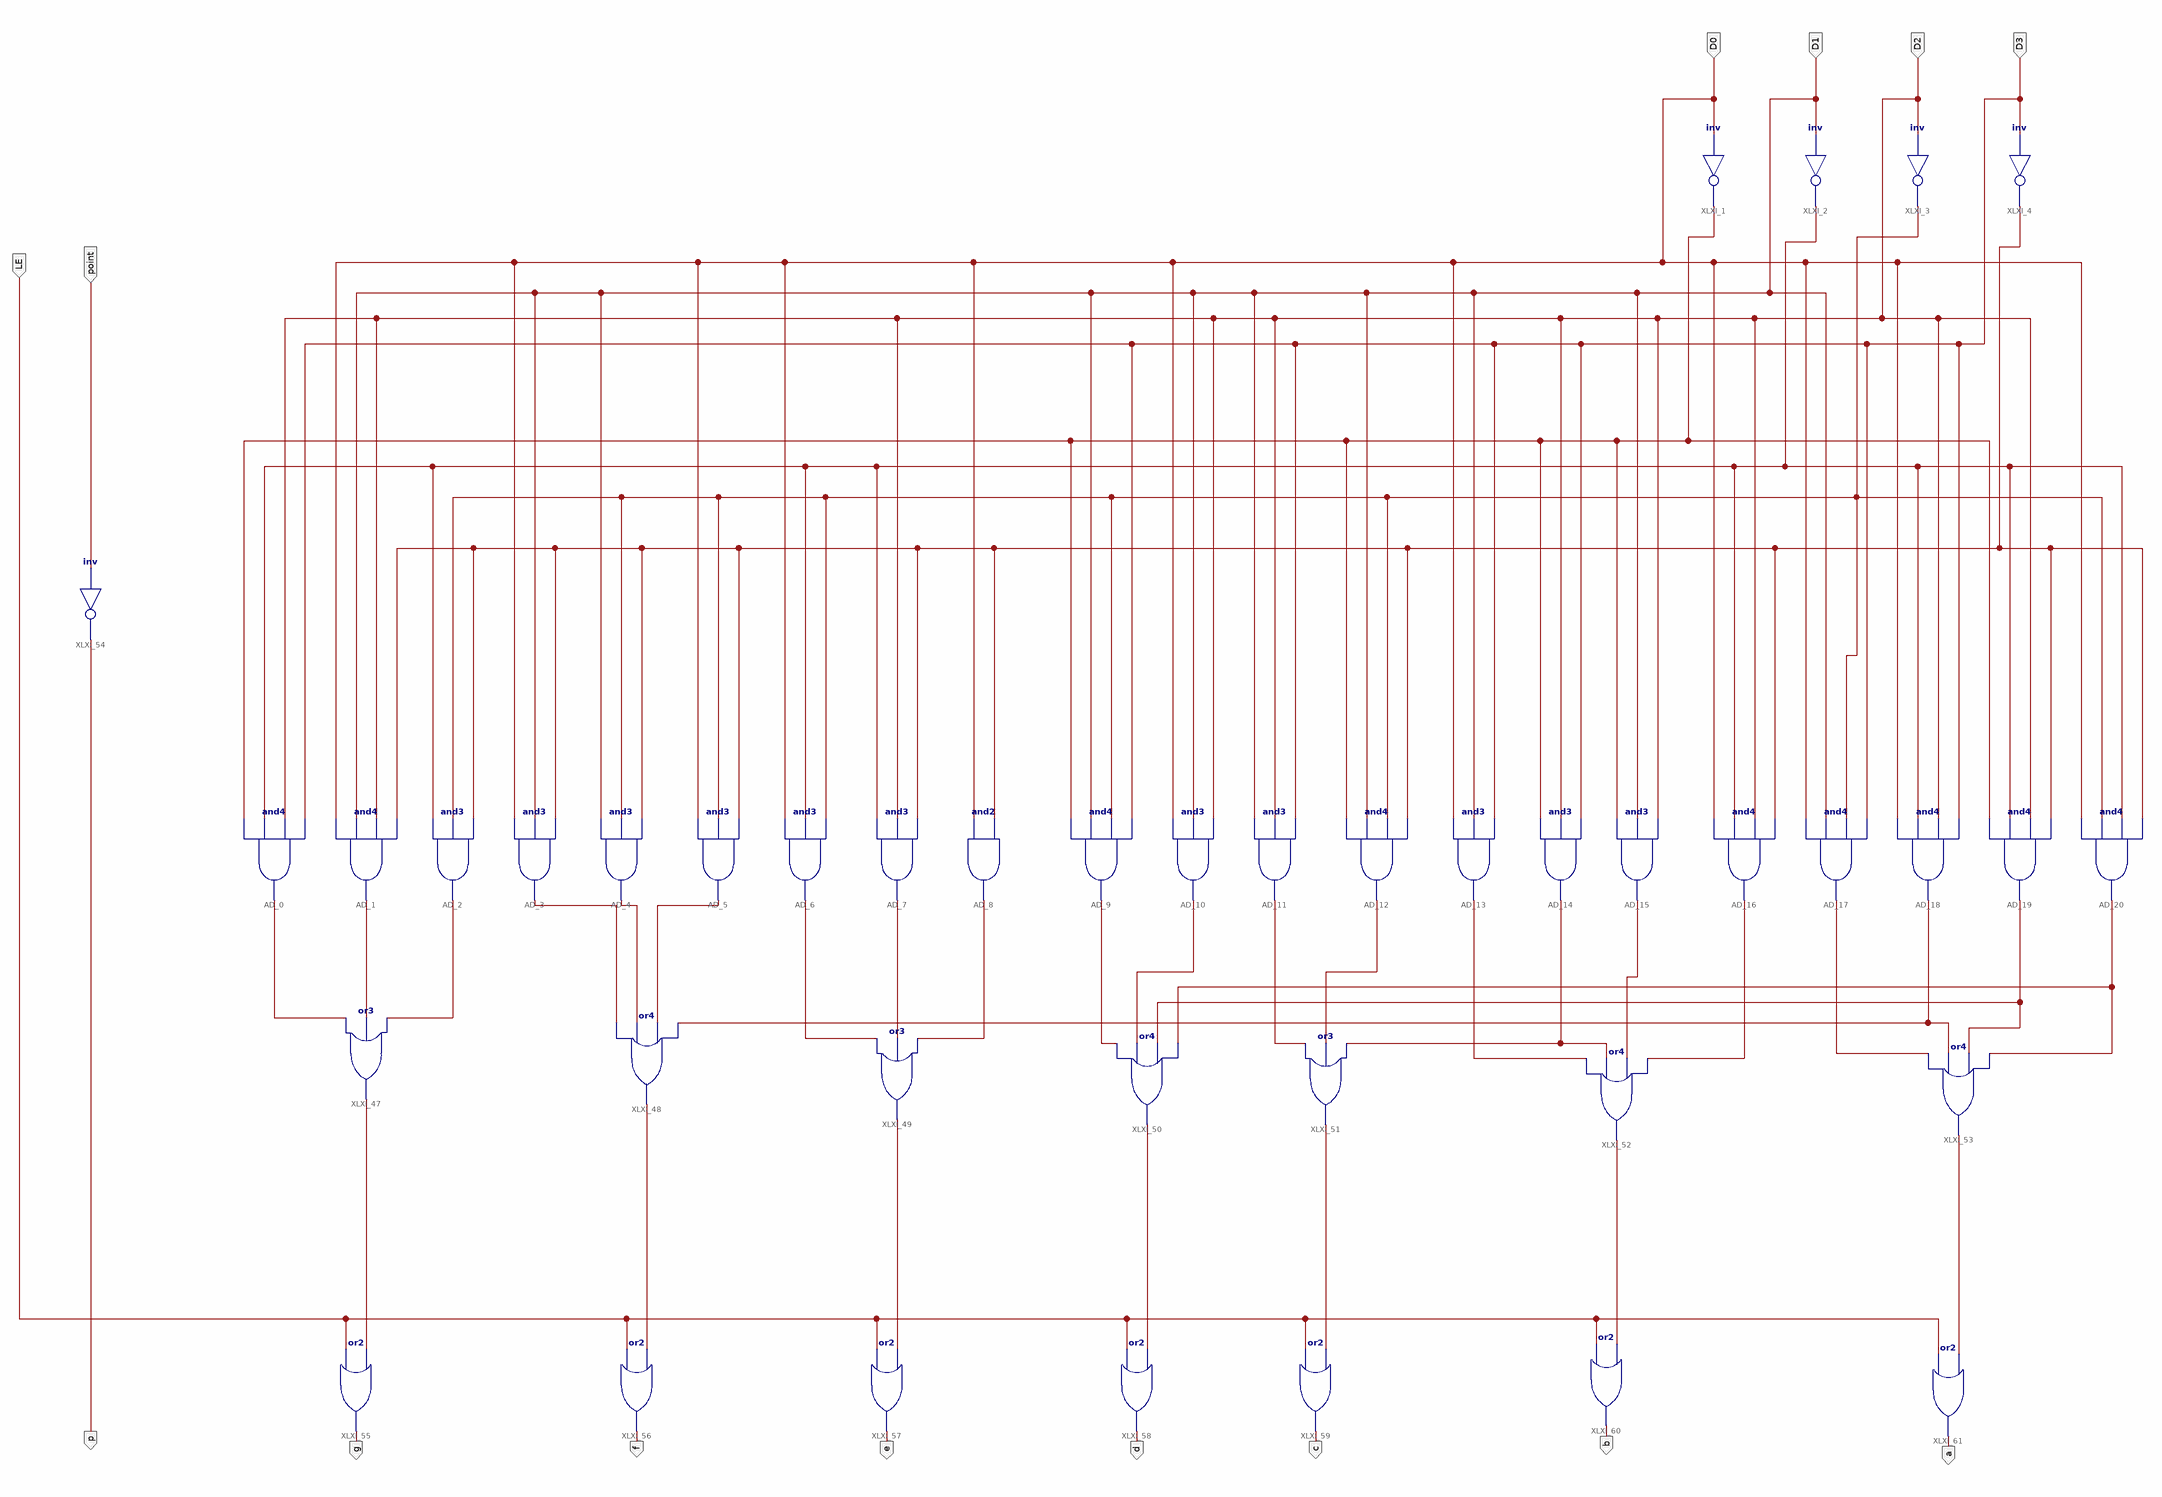
[diagram p0: schematic sheet 1]
// Xilinx ISE schematic MyMC14495.sch (kintex7) as structural Verilog: 40 symbols, 14 ports
module MyMC14495 (
  input  D0,
  input  D1,
  input  D2,
  input  D3,
  input  LE,
  input  point,
  output p,
  output a,
  output b,
  output c,
  output d,
  output e,
  output f,
  output g
);

  wire XLXN_19, XLXN_24, XLXN_28, XLXN_34, XLXN_37, XLXN_39, XLXN_40, XLXN_41, XLXN_42, XLXN_43, XLXN_44,
       XLXN_53, XLXN_54, XLXN_55, XLXN_56, XLXN_57, XLXN_58, XLXN_59, XLXN_60, XLXN_61, XLXN_62, XLXN_63,
       XLXN_65, XLXN_66, XLXN_67, XLXN_73, XLXN_74, XLXN_75, XLXN_76, XLXN_77, XLXN_78, XLXN_79;

  and AD_1 (XLXN_39, D0, D1, D2, XLXN_34);
  and AD_9 (XLXN_56, XLXN_19, D1, XLXN_28, D3);
  and AD_12 (XLXN_61, XLXN_19, D1, XLXN_28, XLXN_34);
  and AD_16 (XLXN_66, D0, XLXN_24, D2, XLXN_34);
  and AD_17 (XLXN_67, D0, D1, XLXN_28, D3);
  and AD_18 (XLXN_44, D0, XLXN_24, D2, D3);
  and AD_19 (XLXN_58, XLXN_19, XLXN_24, D2, XLXN_34);
  and AD_20 (XLXN_59, D0, XLXN_28, XLXN_24, XLXN_34);
  and AD_0 (XLXN_37, XLXN_19, XLXN_24, D2, D3);
  not XLXI_1 (XLXN_19, D0);
  not XLXI_2 (XLXN_24, D1);
  not XLXI_3 (XLXN_28, D2);
  not XLXI_4 (XLXN_34, D3);
  and AD_2 (XLXN_40, XLXN_24, XLXN_28, XLXN_34);
  and AD_3 (XLXN_41, D0, D1, XLXN_34);
  and AD_4 (XLXN_42, D1, XLXN_28, XLXN_34);
  and AD_5 (XLXN_43, D0, XLXN_28, XLXN_34);
  and AD_6 (XLXN_53, D0, XLXN_24, XLXN_28);
  and AD_7 (XLXN_54, XLXN_24, D2, XLXN_34);
  and AD_8 (XLXN_55, D0, XLXN_34);
  and AD_10 (XLXN_57, D0, D1, D2);
  and AD_11 (XLXN_60, D1, D2, D3);
  and AD_13 (XLXN_63, D0, D1, D3);
  and AD_14 (XLXN_62, XLXN_19, D2, D3);
  and AD_15 (XLXN_65, XLXN_19, D1, D2);
  or XLXI_47 (XLXN_79, XLXN_37, XLXN_39, XLXN_40);
  or XLXI_48 (XLXN_78, XLXN_41, XLXN_42, XLXN_43, XLXN_44);
  or XLXI_49 (XLXN_77, XLXN_53, XLXN_54, XLXN_55);
  or XLXI_50 (XLXN_76, XLXN_56, XLXN_57, XLXN_58, XLXN_59);
  or XLXI_51 (XLXN_75, XLXN_60, XLXN_61, XLXN_62);
  or XLXI_52 (XLXN_74, XLXN_63, XLXN_62, XLXN_65, XLXN_66);
  or XLXI_53 (XLXN_73, XLXN_67, XLXN_44, XLXN_58, XLXN_59);
  not XLXI_54 (p, point);
  or XLXI_55 (g, LE, XLXN_79);
  or XLXI_56 (f, LE, XLXN_78);
  or XLXI_57 (e, LE, XLXN_77);
  or XLXI_58 (d, LE, XLXN_76);
  or XLXI_59 (c, LE, XLXN_75);
  or XLXI_60 (b, LE, XLXN_74);
  or XLXI_61 (a, LE, XLXN_73);
endmodule
